# EAGLE design Drinkro (EAGLE 7.5.0)
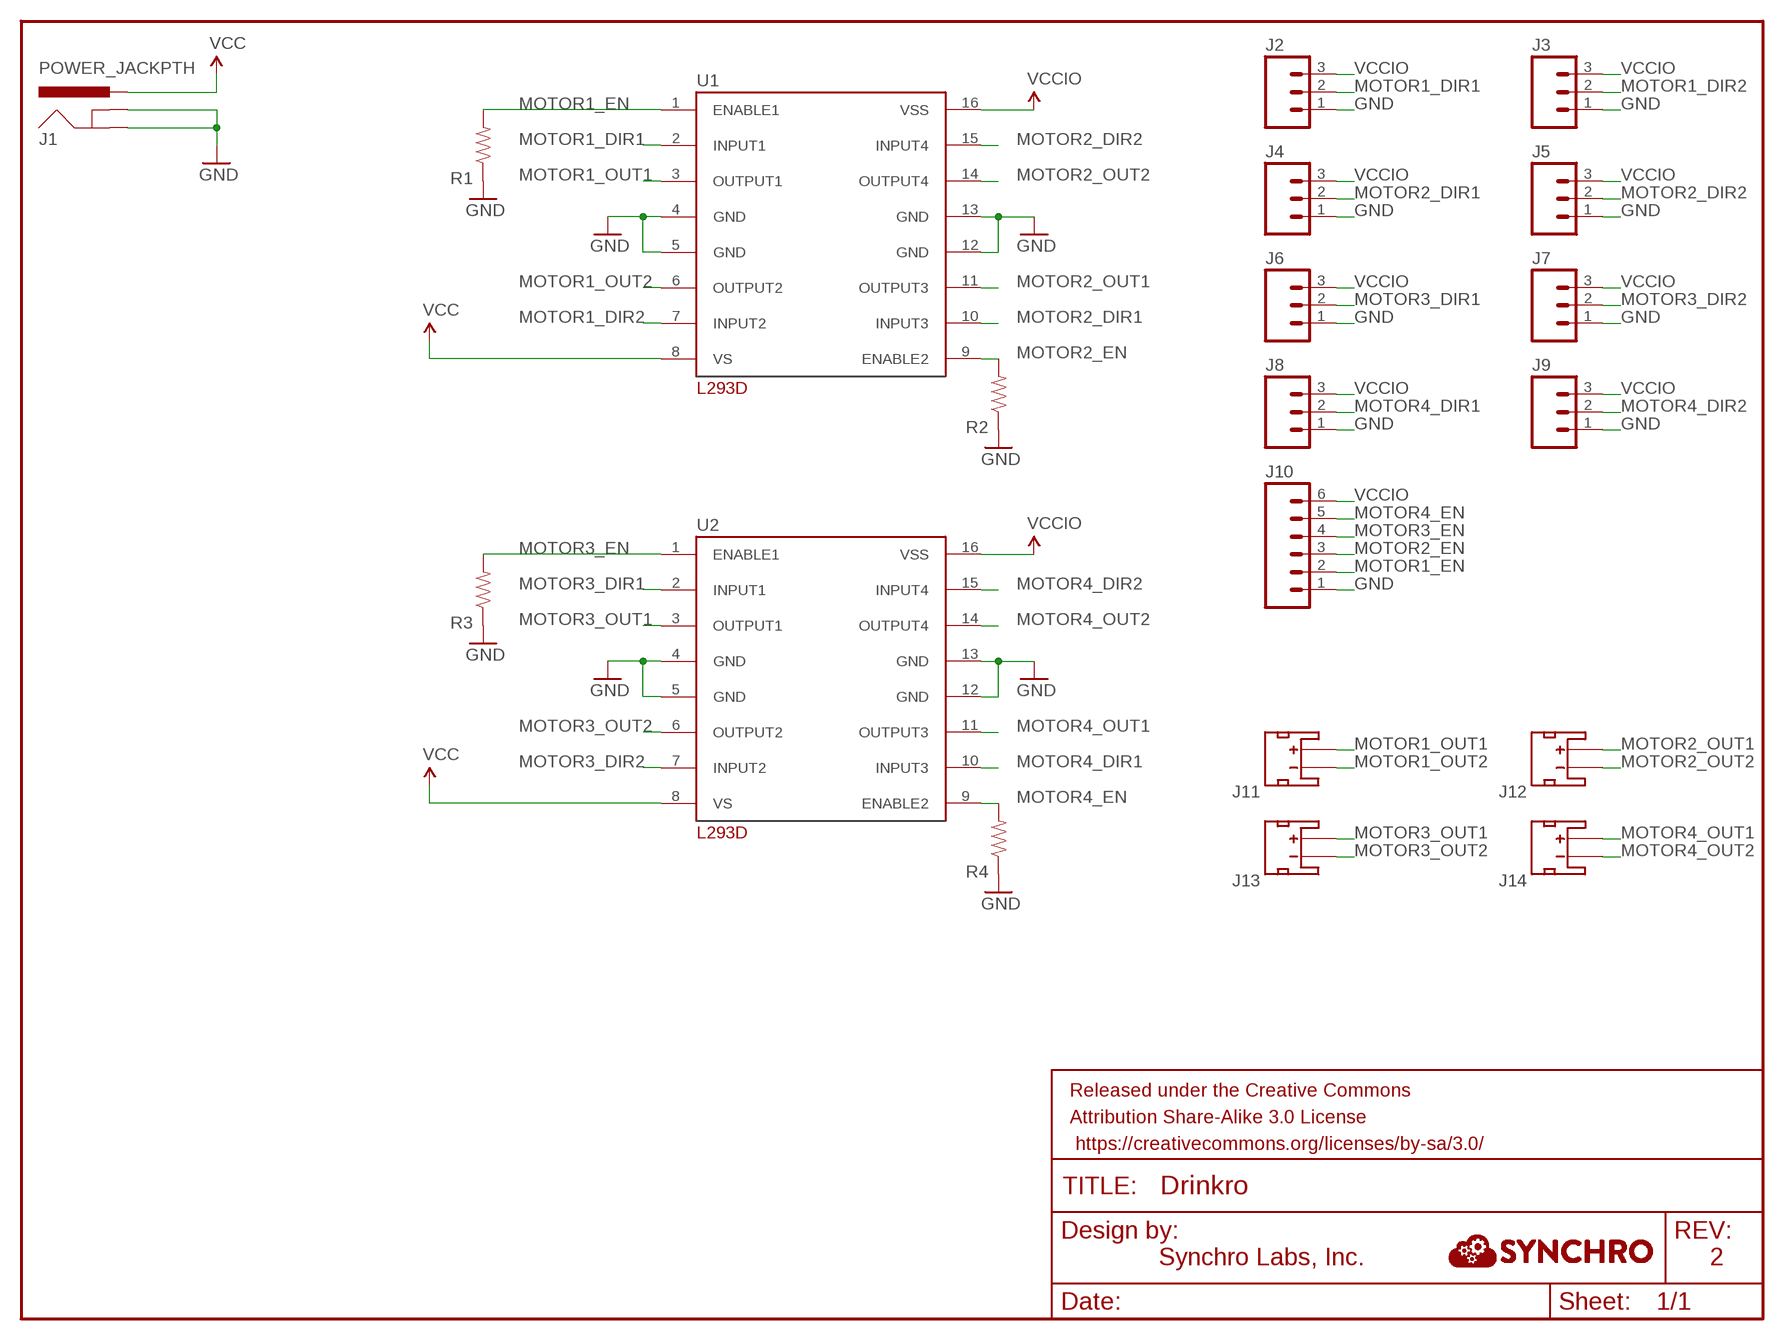
[diagram p0: schematic, sheet 1]

## Parts
FRAME1  FRAME-LETTER  [CREATIVE_COMMONS]
J1  POWER_JACKPTH  [POWER_JACK_PTH]
J2  M03PTH  [1X03]
J3  M03PTH  [1X03]
J4  M03PTH  [1X03]
J5  M03PTH  [1X03]
J6  M03PTH  [1X03]
J7  M03PTH  [1X03]
J8  M03PTH  [1X03]
J9  M03PTH  [1X03]
J10  M06SILK_FEMALE_PTH  [1X06]
J11  JST_2MM_MALE  [JST-2-SMD]
J12  JST_2MM_MALE  [JST-2-SMD]
J13  JST_2MM_MALE  [JST-2-SMD]
J14  JST_2MM_MALE  [JST-2-SMD]
R1  RESISTOR0805-RES  [0805]
R2  RESISTOR0805-RES  [0805]
R3  RESISTOR0805-RES  [0805]
R4  RESISTOR0805-RES  [0805]
U1  L293D  [DIP]
U2  L293D  [DIP]

## Nets
GND: J1.GND J1.GNDBREAK J2.1 J3.1 J4.1 J5.1 J6.1 J7.1 J8.1 J9.1 J10.1 R1.1 R2.1 R3.1 R4.1 U1.4(GND) U1.5(GND) U1.12(GND) U1.13(GND) U2.4(GND) U2.5(GND) U2.12(GND) U2.13(GND)
MOTOR1_DIR1: J2.2 U1.2(INPUT1)
MOTOR1_DIR2: J3.2 U1.7(INPUT2)
MOTOR1_EN: J10.2 R1.2 U1.1(ENABLE1)
MOTOR1_OUT1: J11.2(+) U1.3(OUTPUT1)
MOTOR1_OUT2: J11.1(-) U1.6(OUTPUT2)
MOTOR2_DIR1: J4.2 U1.10(INPUT3)
MOTOR2_DIR2: J5.2 U1.15(INPUT4)
MOTOR2_EN: J10.3 R2.2 U1.9(ENABLE2)
MOTOR2_OUT1: J12.2(+) U1.11(OUTPUT3)
MOTOR2_OUT2: J12.1(-) U1.14(OUTPUT4)
MOTOR3_DIR1: J6.2 U2.2(INPUT1)
MOTOR3_DIR2: J7.2 U2.7(INPUT2)
MOTOR3_EN: J10.4 R3.2 U2.1(ENABLE1)
MOTOR3_OUT1: J13.2(+) U2.3(OUTPUT1)
MOTOR3_OUT2: J13.1(-) U2.6(OUTPUT2)
MOTOR4_DIR1: J8.2 U2.10(INPUT3)
MOTOR4_DIR2: J9.2 U2.15(INPUT4)
MOTOR4_EN: J10.5 R4.2 U2.9(ENABLE2)
MOTOR4_OUT1: J14.2(+) U2.11(OUTPUT3)
MOTOR4_OUT2: J14.1(-) U2.14(OUTPUT4)
VCC: J1.PWR U1.8(VS) U2.8(VS)
VCCIO: J2.3 J3.3 J4.3 J5.3 J6.3 J7.3 J8.3 J9.3 J10.6 U1.16(VSS) U2.16(VSS)
Unconnected: J11.NC1(PAD1) J11.NC2(PAD2) J12.NC1(PAD1) J12.NC2(PAD2) J13.NC1(PAD1) J13.NC2(PAD2) J14.NC1(PAD1) J14.NC2(PAD2)

## Notes on the sheet
- Synchro Labs, Inc. | 2

## Library data of the parts
FRAME1 = SparkFun-Retired:FRAME-LETTER: Schematic Frame Standard 8.5x11 US Letter frame
J1 = SparkFun-Connectors:POWER_JACK: Power Jack This is the standard 5.5mm barrel jack for power. The PTH is the most common, proven, reliable, footprint. The Slot footprint only works if the mill layer is transmitted to the PCB fab house so be warned. Mating wall wart : TOL-00298 (and others); PROD_ID: CONN-08197
J2-J9 = SparkFun-Connectors:M03: Header 3 Standard 3-pin 0.1" header. Use with straight break away headers (SKU : PRT-00116), right angle break away headers (PRT-00553), swiss pins (PRT-00743), machine pins (PRT-00117), and female headers (PRT-00115). Molex polarized connector foot print use with SKU : PRT-08232 with associated crimp pins and housings.
J10 = SparkFun-Connectors:M06: Header 6 Standard 6-pin 0.1" header. Use with straight break away headers (SKU : PRT-00116), right angle break away headers (PRT-00553), swiss pins (PRT-00743), machine pins (PRT-00117), and female headers (PRT-00115). Molex polarized connector foot print use with SKU : PRT-08094 with associated crimp pins and housings. NOTES ON THE VARIANTS LOCK and LOCK_LONGPADS... This footprint was designed to help hold the alignment of a through-hole component (i.e. 6-pin header) while soldering it into place. You may notice that each hole has been shifted either up or down by 0.005 of an inch from it's more standard position (which is a perfectly straight line). This slight alteration caused the pins (the squares in the middle) to touch the edges of the holes. Because they are alternating, it causes a "brace" to hold the component in place. 0.005 has proven to be the perfect amount of "off-center" position when using our standard breakaway headers. Although looks a little odd when you look at the bare footprint, once you have a header in there, the alteration is very hard to notice. Also,if you push a header all the way into place, it is covered up entirely on the bottom side. This idea of altering the position of holes to aid alignment will be further integrated into the Sparkfun Library for other footprints. It can help hold any component with 3 or more connection pins.; PROD_ID: CONN-08437
J11-J14 = SparkFun-Connectors:JST_2MM_MALE: Mates to single-cell LiPo batteries. CONN-11443 Now with smashable polarity marks!; BTM_NEG: -; BTM_POS: +; PROD_ID: CONN-11443; TOP_NEG: -; TOP_POS: +
R1-R4 = SparkFun-Passives:RESISTOR: Resistor Basic schematic elements and footprints for 0603, 1206, and PTH resistors.
U1 U2 = Drinkro:L293D

## Board
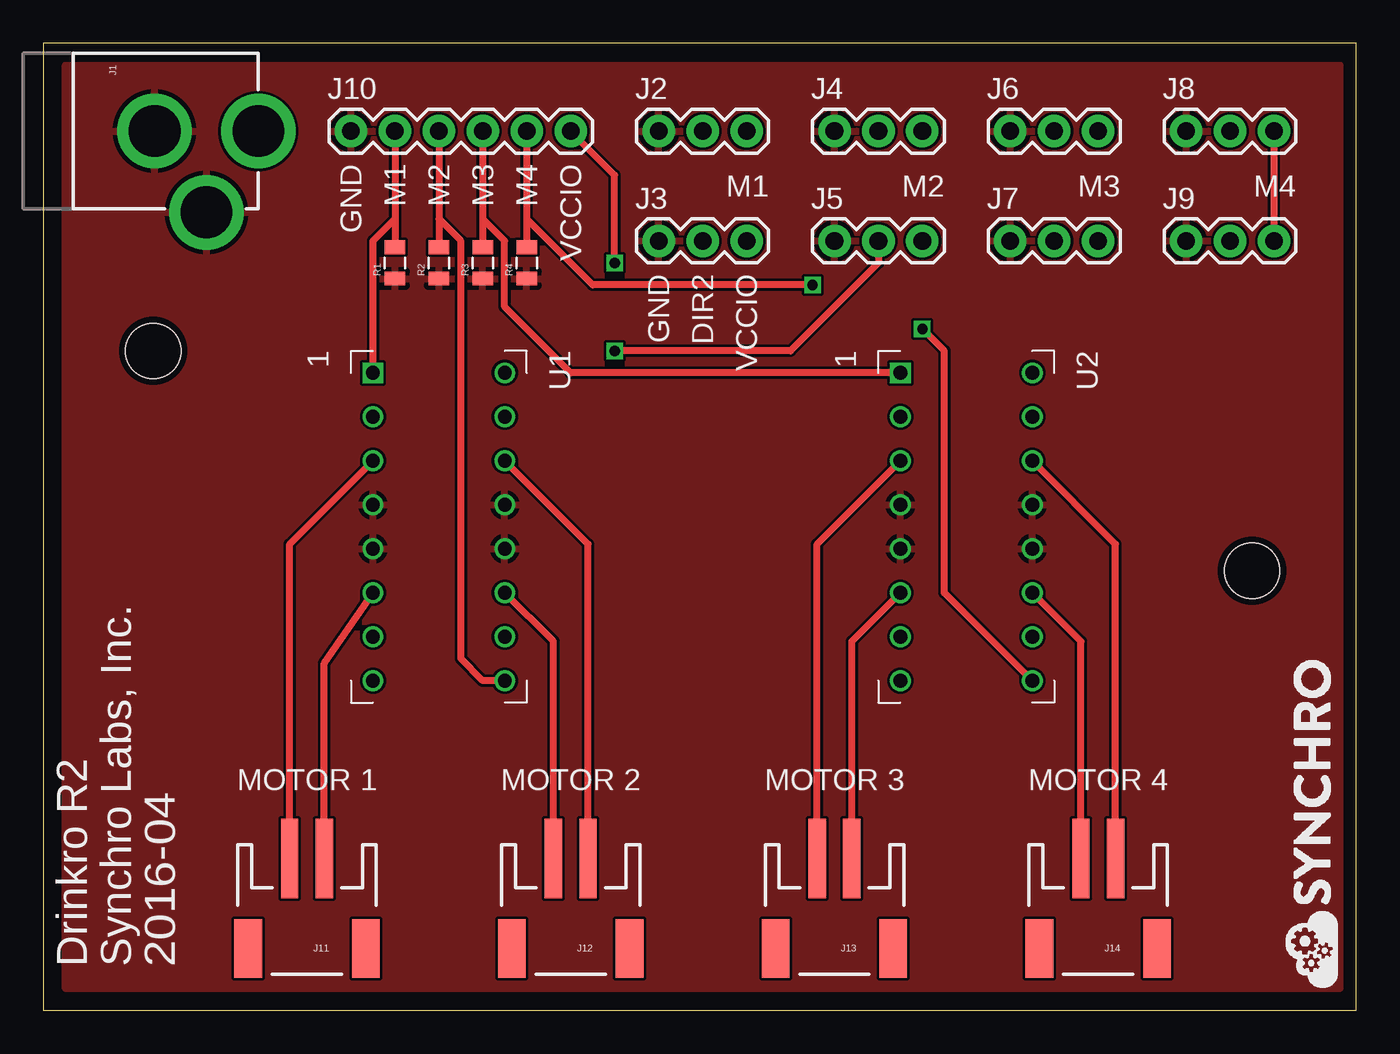
[diagram p1: board, top side]
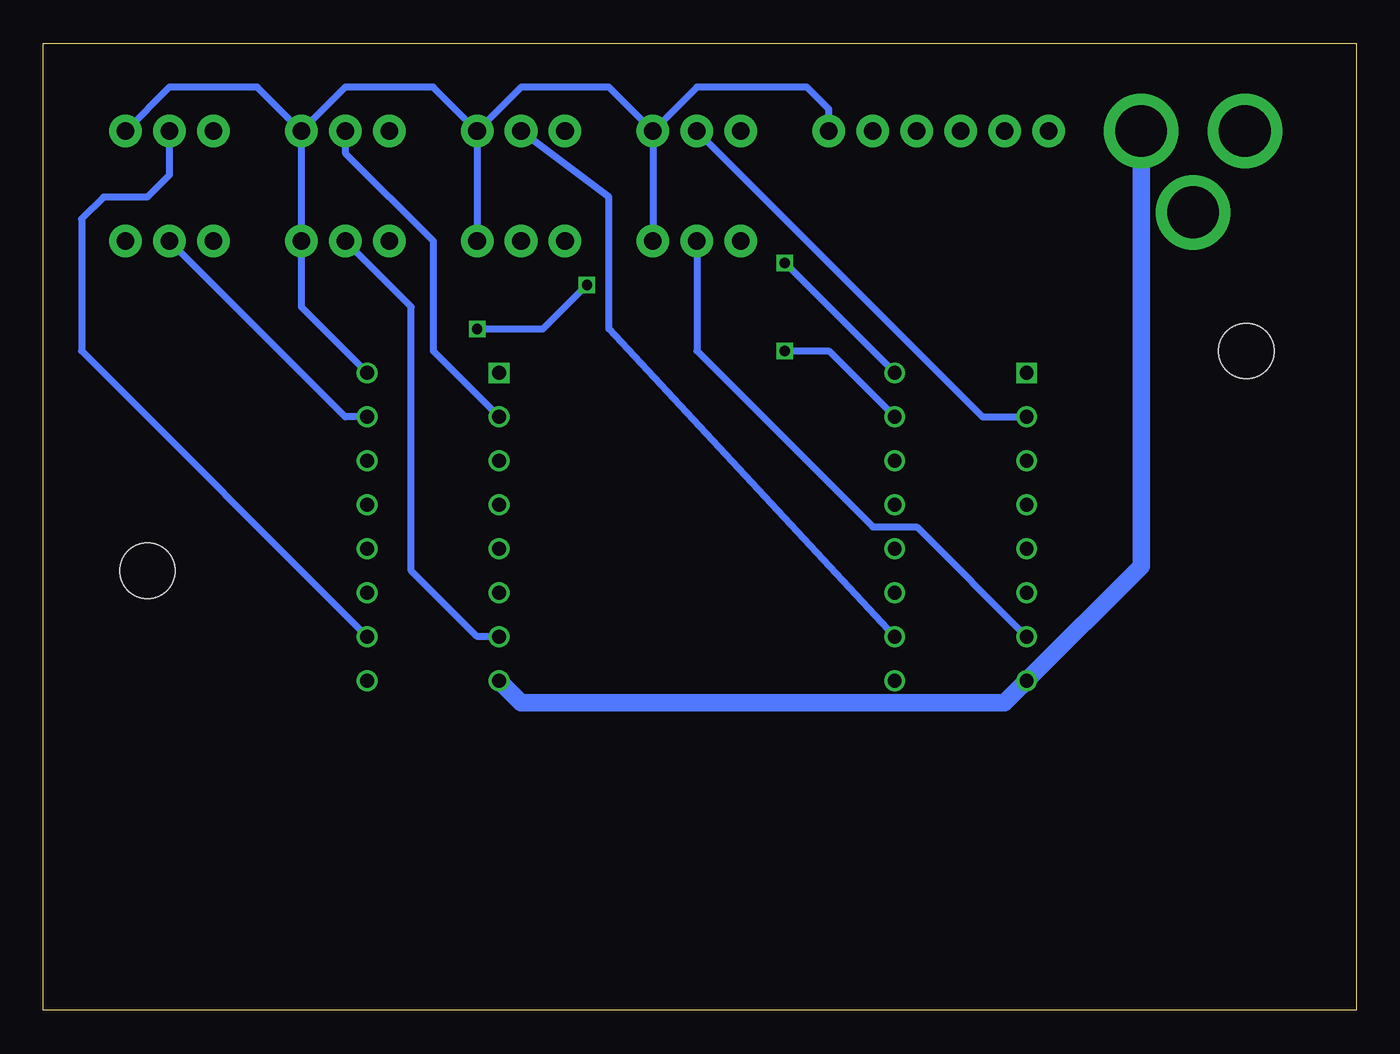
[diagram p2: board, bottom side, seen from below]

Size 75.87 x 55.87 mm. Coordinates in mm from the lower left corner, seen from the top.
Outline: 0,0 75.87,0 75.87,55.87 0,55.87 0,0
Copper layers (1*16): Top 0.0356mm / dielectric 1.5011mm / Bottom 0.0356mm
Design rules "LaenPCBOrder": minimum track width 6mil, minimum drill 13mil, track to track 6mil, track to pad 6mil, pad to pad 6mil, via to via 6mil, smd to smd 6mil, copper to edge 15mil, drill to drill 6mil, minimum pad ring 7mil, minimum via ring 7mil, stop-mask expansion 3mil, vias tented up to drill 0mil, thermal gap 10mil
Holes 3.17 mm at 69.85,25.4 6.35,38.1

### Footprints (pad centres in the part's own frame; a part is rotated, then mirrored left to right if it is on the bottom)
POWER_JACK_PTH = drill 2.997 pad 4.318: GND 0,7.7; GNDBREAK 4.7,10.7; PWR 0,13.7
1X03 = drill 1.016 pad 1.88: 1 0,0; 2 2.54,0; 3 5.08,0
1X06 = drill 1.016 pad 1.88: 1 0,0; 2 2.54,0; 3 5.08,0; 4 7.62,0; 5 10.16,0; 6 12.7,0
JST-2-SMD = smd 1 x 4.6: 1 -1,-3.7; 2 1,-3.7 | smd 1.6 x 3.4: NC1 -3.4,1.5; NC2 3.4,1.5
0805 = smd 0.8 x 1.2: 1 -0.9,0; 2 0.9,0
DIP = drill 0.8 square: 1 -8.89,-3.81 | drill 0.8: 2 -6.35,-3.81; 3 -3.81,-3.81; 4 -1.27,-3.81; 5 1.27,-3.81; 6 3.81,-3.81; 7 6.35,-3.81; 8 8.89,-3.81; 9 8.89,3.81; 10 6.35,3.81; 11 3.81,3.81; 12 1.27,3.81; 13 -1.27,3.81; 14 -3.81,3.81; 15 -6.35,3.81; 16 -8.89,3.81

### Placement (x,y rotation side)
FRAME1  15.24,-10.16 0 top  (outside the outline)
J1  -1.27,50.8 270 top
J2  35.56,50.8 0 top
J3  35.56,44.45 0 top
J4  45.72,50.8 0 top
J5  45.72,44.45 0 top
J6  55.88,50.8 0 top
J7  55.88,44.45 0 top
J8  66.04,50.8 0 top
J9  66.04,44.45 0 top
J10  17.78,50.8 0 top
J11  15.24,5.08 180 top
J12  30.48,5.08 180 top
J13  45.72,5.08 180 top
J14  60.96,5.08 180 top
R1  20.32,43.18 90 top
R2  22.86,43.18 90 top
R3  25.4,43.18 90 top
R4  27.94,43.18 90 top
U1  22.86,27.94 270 top
U2  53.34,27.94 270 top

### Tracks (layer width: path | path; a pad name or v marks a point on that pad's centre or on a via)
GND
  pour Top: 1.27,54.61 74.93,54.61 74.93,1.27 1.27,1.27
MOTOR1_DIR1
  Bottom 0.406: J2.2 21.59,34.29 U1.2
MOTOR1_DIR2
  Bottom 0.406: J3.2 38.1,38.1 27.94,27.94 25.4,27.94 U1.7
MOTOR1_EN
  Top 0.406: J10.2 20.32,45.72 | 20.32,45.72 R1.2 | U1.1 19.05,44.45 20.32,45.72
MOTOR1_OUT1
  Top 0.406: J11.2 14.24,26.94 U1.3
MOTOR1_OUT2
  Top 0.406: J11.1 16.24,20.05 U1.6
MOTOR2_DIR1
  Bottom 0.406: U1.10 43.18,39.37 43.18,46.99 J4.2
MOTOR2_DIR2  (via drill 0.6)
  Top 0.406: J5.2 48.26,43.18 43.18,38.1 v33.02,38.1
  Bottom 0.406: v33.02,38.1 30.48,38.1 U1.15
MOTOR2_EN
  Top 0.406: J10.3 22.86,45.72 | 22.86,45.72 R2.2 | U1.9 25.4,19.05 24.13,20.32 24.13,44.45 22.86,45.72
MOTOR2_OUT1
  Top 0.406: J12.2 29.48,21.32 U1.11
MOTOR2_OUT2
  Top 0.406: J12.1 31.48,26.94 U1.14
MOTOR3_DIR1
  Bottom 0.406: J6.2 58.42,49.53 53.34,44.45 53.34,38.1 U2.2
MOTOR3_DIR2
  Bottom 0.406: U2.7 50.8,21.59 54.61,25.4 54.61,40.64 J7.2
MOTOR3_EN
  Top 0.406: J10.4 25.4,45.72 | 25.4,45.72 R3.2 | U2.1 30.48,36.83 26.67,40.64 26.67,44.45 25.4,45.72
MOTOR3_OUT1
  Top 0.406: J13.2 44.72,26.94 U2.3
MOTOR3_OUT2
  Top 0.406: J13.1 46.72,21.32 U2.6
MOTOR4_DIR1
  Bottom 0.406: J8.2 68.58,48.26 69.85,46.99 72.39,46.99 73.66,45.72 73.66,38.1 U2.10
MOTOR4_DIR2
  Bottom 0.406: U2.15 58.42,34.29 J9.2
MOTOR4_EN  (via drill 0.6)
  Top 0.406: J10.5 27.94,45.72 | 27.94,45.72 R4.2 | U2.9 52.07,24.13 52.07,38.1 v50.8,39.37 | v44.45,41.91 31.75,41.91 27.94,45.72
  Bottom 0.406: v50.8,39.37 46.99,39.37 v44.45,41.91
MOTOR4_OUT1
  Top 0.406: J14.2 59.96,21.32 U2.11
MOTOR4_OUT2
  Top 0.406: J14.1 61.96,26.94 U2.14
VCC
  Bottom 1.016: J1.PWR 12.43,25.67 U1.8 20.32,17.78 48.26,17.78 U2.8
VCCIO  (via drill 0.6)
  Top 0.406: J8.3 J9.3 | v33.02,43.18 33.02,48.26 J10.6
  Bottom 0.406: J10.6 30.48,52.07 31.75,53.34 38.1,53.34 J2.3 | J2.3 43.18,53.34 48.26,53.34 J4.3 | J4.3 53.34,53.34 58.42,53.34 J6.3 | J6.3 63.5,53.34 68.58,53.34 J8.3 | J6.3 J7.3 60.96,40.64 U2.16 | J4.3 J5.3 | J2.3 J3.3 | U1.16 v33.02,43.18

### Text on the board
tPlace: GND | VCCIO | GND | DIR2 | VCCIO | MOTOR 1 | MOTOR 2 | MOTOR 3 | MOTOR 4
tNames: M1 | M2 | M3 | M4 | M1 | M2 | M3 | M4 | Drinkro R2 | Synchro Labs, Inc. | 2016-04